# Altium schematic sheet uController.SchDoc
size A4
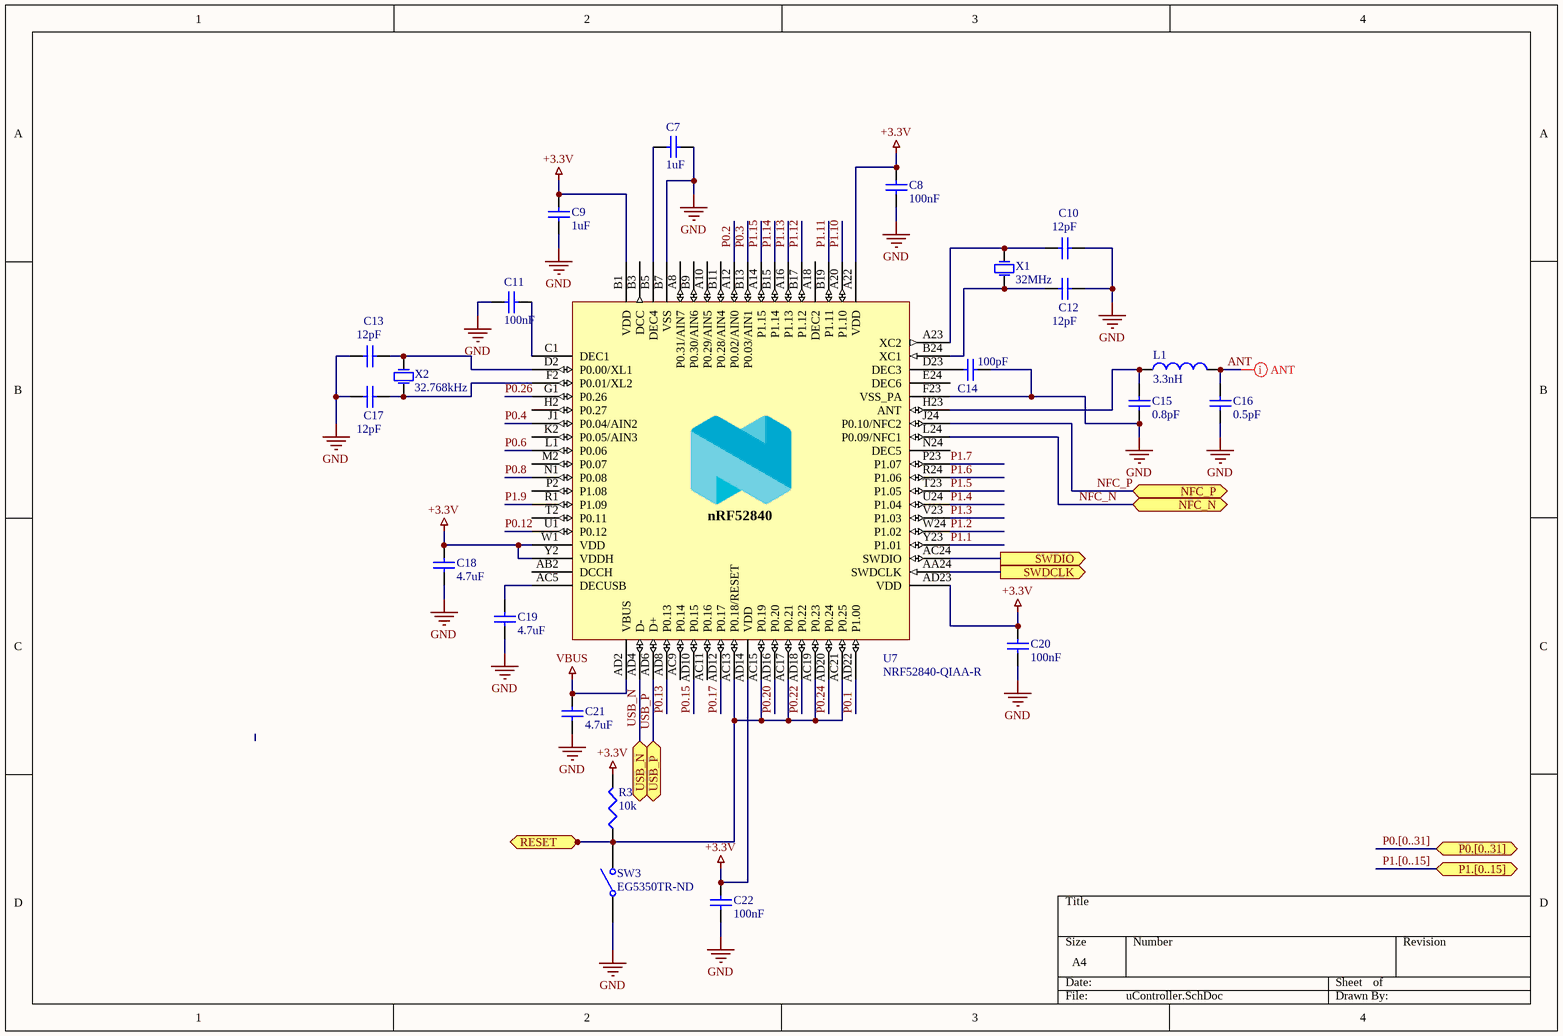
[diagram p0: uController.SchDoc]

## Parts
C7  value 1uF  (hidden comment: CL10A105KA8NNNC)
C8  value 100nF  (hidden comment: CL05A104KA5NNNC)
C9  value 1uF  (hidden comment: CL10A105KA8NNNC)
C10  value 12pF  (hidden comment: CL10C120JB8NNNC)
C11  value 100nF  (hidden comment: CL05A104KA5NNNC)
C12  value 12pF  (hidden comment: CL10C120JB8NNNC)
C13  value 12pF  (hidden comment: CL10C120JB8NNNC)
C14  value 100pF  (hidden comment: 885012206028)
C15  value 0.8pF  (hidden comment: CL10C0R8BB8NNNC)
C16  value 0.5pF  (hidden comment: CL10C0R5BB8NNNC)
C17  value 12pF  (hidden comment: CL10C120JB8NNNC)
C18  value 4.7uF  (hidden comment: CL21A475KAQNNNE)
C19  value 4.7uF  (hidden comment: CL21A475KAQNNNE)
C20  value 100nF  (hidden comment: CL05A104KA5NNNC)
C21  value 4.7uF  (hidden comment: CL21A475KAQNNNE)
C22  value 100nF  (hidden comment: CL05A104KA5NNNC)
L1  value 3.3nH  (hidden comment: CIH05T3N3SNC)
R3  value 10k  (hidden comment: RR0816P-103-D)
SW3  EG5350TR-ND  [SW1]
U7  NRF52840-QIAA-R
X1  value 32MHz  (hidden comment: NX2016SA-32MHZ-EXS00A-CS11336)
X2  value 32.768kHz  (hidden comment: Q0,032768-JTX210-9-20-T1-80K-LF)

## Ports
NFC_N, NFC_P, P0.[0..31] (bidir), P1.[0..15] (bidir), RESET (out), SWDCLK (out), SWDIO (out), USB_N, USB_P

## Nets
+3.3V: C8.1 C9.2 C18.2 C20.1 C22.1 R3.2 U7.A22(VDD) U7.AD14(VDD) U7.AD23(VDD) U7.B1(VDD) U7.W1(VDD) U7.Y2(VDDH)
GND: C7.1 C8.2 C9.1 C10.2 C11.2 C12.2 C13.1 C14.2 C15.1 C16.2 C17.1 C18.1 C19.1 C20.2 C21.1 C22.2 SW3.1 U7.B7(VSS) U7.F23(VSS_PA) X1.1(GND) X1.3(GND)
VBUS: C21.2 U7.AD2(VBUS)
ANT: C16.1 L1.2
NFC_N: U7.L24(P0.09/NFC1) ; port NFC_N
NFC_P: U7.J24(P0.10/NFC2) ; port NFC_P
P0.1: U7.AD22(P1.00)
P0.2: U7.A12(P0.02/AIN0)
P0.3: U7.B13(P0.03/AIN1)
P0.4: U7.J1(P0.04/AIN2)
P0.6: U7.L1(P0.06)
P0.8: U7.N1(P0.08)
P0.12: U7.U1(P0.12)
P0.13: U7.AD8(P0.13)
P0.15: U7.AD10(P0.15)
P0.17: U7.AD12(P0.17)
P0.20: U7.AD16(P0.20)
P0.22: U7.AD18(P0.22)
P0.24: U7.AD20(P0.24)
P0.26: U7.G1(P0.26)
P1.1: U7.Y23(P1.01)
P1.2: U7.W24(P1.02)
P1.3: U7.V23(P1.03)
P1.4: U7.U24(P1.04)
P1.5: U7.T23(P1.05)
P1.6: U7.R24(P1.06)
P1.7: U7.P23(P1.07)
P1.9: U7.R1(P1.09)
P1.10: U7.A20(P1.10)
P1.11: U7.B19(P1.11)
P1.12: U7.B17(P1.12)
P1.13: U7.A16(P1.13)
P1.14: U7.B15(P1.14)
P1.15: U7.A14(P1.15)
RESET: R3.1 SW3.3 U7.AC13(P0.18/RESET) U7.AC15(P0.19) U7.AC17(P0.21) U7.AC19(P0.23) U7.AC21(P0.25) ; port RESET
SWDCLK: U7.AA24(SWDCLK) ; port SWDCLK
SWDIO: U7.AC24(SWDIO) ; port SWDIO
USB_N: U7.AD4(D-) ; port USB_N
USB_P: U7.AD6(D+) ; port USB_P
NetC7_2: C7.2 U7.B5(DEC4)
NetC10_1: C10.1 U7.A23(XC2) X1.4(OSC2)
NetC11_1: C11.1 U7.C1(DEC1)
NetC12_1: C12.1 U7.B24(XC1) X1.2(OSC1)
NetC13_2: C13.2 U7.D2(P0.00/XL1) X2.2(OSC2)
NetC14_1: C14.1 U7.D23(DEC3)
NetC15_2: C15.2 L1.1 U7.H23(ANT)
NetC17_2: C17.2 U7.F2(P0.01/XL2) X2.1(OSC1)
NetC19_2: C19.2 U7.AC5(DECUSB)

Not connected (* = marked no-connect by the designer): SW3 2 4; U7 A8(P0.31/AIN7) A10(P0.29/AIN5) A18(DEC2) AB2(DCCH) AC9(P0.14) AC11(P0.16) B3(DCC) B9(P0.30/AIN6) B11(P0.28/AIN4) E24(DEC6) H2(P0.27) K2(P0.05/AIN3) M2(P0.07) N24(DEC5) P2(P1.08) T2(P0.11)

## Buses and harness runs
bus P0.[0..31] = port P0.[0..31]
bus P1.[0..15] = port P1.[0..15]

## Layout directives
net class ANT: ANT

## Notes on the sheet
- (in symbol NRF52840-QIAA-R) nRF52840

## Library data of the parts
C7 C9 = CL10A105KA8NNNC: Cap Ceramic 1uF 25V X5R 10% SMD 0603 85C Paper T/R; Manufacturer: Samsung; Supplier 1: Digi-Key; Manufacturer Part Number: CL10A105KA8NNNC; Stock 1: 40000; Pricing 1: 1=0.1, 10=0.052, 100=0.0231, 500=0.0165, 1000=0.013 (USD); Mount: Surface Mount; Case/Package: 0603; Case Code (Metric): 1608; Case Code (Imperial): 0603; Material: Ceramic; Contact Plating: Tin; Min Operating Temperature: -55°C; Max Operating Temperature: 85°C; Capacitance: 1uF; Tolerance: 10%; Dielectric: X5R; Voltage: 25V; Voltage Rating (DC): 25V; Packaging: Tape and Reel; Package Quantity: 1; Voltage Rating: 25V; Length: 1.6mm; Height: 0.8mm; Depth: 0.8mm; Width: 0.031inch; Thickness: 0.035inch; Radiation Hardening: No; Lead Free: Lead Free; Supplier Part Number 1: 1276-1102-1-ND
C8 C11 C20 C22 = CL05A104KA5NNNC: Cap Ceramic 0.1uF 25V X5R 10% SMD 0402 85C Paper T/R; Manufacturer: Samsung; Supplier 1: Digi-Key; Manufacturer Part Number: CL05A104KA5NNNC; Stock 1: 100000; Pricing 1: 1=0.1, 10=0.04, 100=0.0176, 500=0.0126, 1000=0.0099, 2500=0.009, 5000=0.0083 (USD); Mount: Surface Mount; Case/Package: 0402; Case Code (Metric): 1005; Case Code (Imperial): 0402; Min Operating Temperature: -55°C; Max Operating Temperature: 85°C; Capacitance: 100nF; Packaging: Tape and Reel; Tolerance: 10%; Package Quantity: 1; Voltage Rating: 25V; Dielectric: X5R; Voltage: 25V; Voltage Rating (DC): 25V; Length: 1mm; Height: 0.5mm; Width: 0.02inch; Thickness: 0.022inch; Depth: 0.5mm; Radiation Hardening: No; Lead Free: Lead Free; Supplier Part Number 1: 1276-1043-1-ND
C10 C12 C13 C17 = CL10C120JB8NNNC: Cap Ceramic 12pF 50V C0G 5% SMD 0603 125C Paper T/R; Manufacturer: Samsung; Temperature Coefficient: 300ppm/°C; Supplier 1: Digi-Key; Manufacturer Part Number: CL10C120JB8NNNC; Stock 1: 40000; Pricing 1: 1=0.1, 10=0.07, 100=0.0314, 500=0.0224, 1000=0.0176 (USD); Mount: Surface Mount; Case/Package: 0603; Case Code (Metric): 1608; Case Code (Imperial): 0603; Material: Ceramic; Contact Plating: Tin; Min Operating Temperature: -55°C; Max Operating Temperature: 125°C; Tolerance: 5%; Capacitance: 12pF; Dielectric: C0G; Voltage: 50V; Voltage Rating (DC): 50V; Voltage Rating: 50V; Package Quantity: 1; Packaging: Tape and Reel; Length: 1.6mm; Height: 0.8mm; Depth: 0.8mm; Width: 0.031inch; Thickness: 0.035inch; Radiation Hardening: No; Lead Free: Lead Free; Supplier Part Number 1: 1276-1254-1-ND
C14 = 885012206028: Wurth Elektronik 0603 WCAP-CSGP 100pF Ceramic Multilayer Capacitor, 16 V dc, +125°C, X7R Dielectric, ±10%; Manufacturer: Wurth Electronics; Voltage Rating: 16V; Supplier 1: Digi-Key; Manufacturer Part Number: 885012206028; Stock 1: 4208; Pricing 1: 1=0.1, 10=0.021, 100=0.0192, 500=0.017 (USD); Mount: Surface Mount; Case/Package: 0603; Case Code (Metric): 1608; Case Code (Imperial): 0603; Min Operating Temperature: -55°C; Max Operating Temperature: 125°C; Packaging: Tape and Reel; Capacitance: 100pF; Tolerance: 10%; Length: 0.063inch; Width: 0.031inch; Thickness: 0.034inch; Supplier Part Number 1: 732-7947-1-ND
C15 = CL10C0R8BB8NNNC: Cap Ceramic 0.8pF 50V C0G 0.1pF SMD 0603 125C Paper T/R; Manufacturer: Samsung; Supplier 1: Digi-Key; Manufacturer Part Number: CL10C0R8BB8NNNC; Stock 1: 40000; Pricing 1: 1=0.1, 10=0.059, 100=0.0264, 500=0.0189, 1000=0.0148 (USD); Mount: Surface Mount; Case/Package: 0603; Case Code (Metric): 1608; Case Code (Imperial): 0603; Min Operating Temperature: -55°C; Max Operating Temperature: 125°C; Capacitance: 0.8pF; Packaging: Tape and Reel; Package Quantity: 1; Voltage Rating: 50V; Dielectric: C0G; Voltage Rating (DC): 50V; Length: 1.6mm; Height: 0.8mm; Width: 0.031inch; Thickness: 0.035inch; Depth: 0.8mm; Radiation Hardening: No; Supplier Part Number 1: 1276-2148-1-ND
C16 = CL10C0R5BB8NNNC: Cap Ceramic 0.5pF 50V C0G 0.1pF SMD 0603 125C Paper T/R; Manufacturer: Samsung; Dielectric: NP0; Temperature Coefficient: 300ppm/°C; Supplier 1: Digi-Key; Manufacturer Part Number: CL10C0R5BB8NNNC; Stock 1: 28897; Pricing 1: 1=0.1, 10=0.049, 100=0.0217, 500=0.0155, 1000=0.0122 (USD); Mount: Surface Mount; Case/Package: 0603; Case Code (Metric): 1608; Case Code (Imperial): 0603; Material: Ceramic; Contact Plating: Matte,Tin; Min Operating Temperature: -55°C; Max Operating Temperature: 125°C; Voltage Rating: 50V; Package Quantity: 1; Packaging: Tape and Reel; Capacitance: 0.5pF; Voltage: 50V; Length: 1.6mm; Height: 0.8mm; Width: 0.031inch; Thickness: 0.035inch; Depth: 0.8mm; Radiation Hardening: No; Supplier Part Number 1: 1276-1818-1-ND
C18 C19 C21 = CL21A475KAQNNNE: Cap Ceramic 4.7uF 25V X5R 10% SMD 0805 85C Embossed T/R; Manufacturer: Samsung; Supplier 1: Digi-Key; Manufacturer Part Number: CL21A475KAQNNNE; Stock 1: 20000; Pricing 1: 1=0.23, 10=0.158, 100=0.0802, 500=0.0549, 1000=0.0485 (USD); Mount: Surface Mount; Case/Package: 0805; Case Code (Metric): 2012; Case Code (Imperial): 0805; Min Operating Temperature: -55°C; Max Operating Temperature: 85°C; Package Quantity: 1; Packaging: Tape and Reel; Capacitance: 4.7uF; Tolerance: 10%; Voltage Rating: 25V; Dielectric: X5R; Voltage Rating (DC): 25V; Length: 2mm; Height: 1.25mm; Width: 0.049inch; Thickness: 0.055inch; Depth: 1.25mm; Radiation Hardening: No; Lead Free: Lead Free; Supplier Part Number 1: 1276-1244-1-ND
L1 = CIH05T3N3SNC: Inductor High Frequency Chip Multi-Layer 3.3nH 0.3nH 100MHz 8Q-Factor Ceramic 300mA 190mOhm DCR 0402 T/R; Manufacturer: Samsung; Shielding: Unshielded; DC Resistance (DCR): 190mR; Self Resonant Frequency: 6GHz; Supplier 1: Digi-Key; Manufacturer Part Number: CIH05T3N3SNC; Stock 1: 68140; Pricing 1: 1=0.1, 10=0.015, 100=0.0102, 500=0.0082, 1000=0.007, 2500=0.0063 (USD); Mount: Surface Mount; Case/Package: 0402; Case Code (Metric): 1005; Case Code (Imperial): 0402; Core Material: Ceramic; Min Operating Temperature: -55°C; Max Operating Temperature: 125°C; Packaging: Cut Tape; Current Rating: 300mA; Inductance: 3.3nh; Test Frequency: 100MHz; Max DC Current: 300mA; DC Current: 300mA; Military Standard: Not; Length: 0.039inch; Height: 0.55mm; Width: 0.02inch; Depth: 0.55mm; Radiation Hardening: No; Lead Free: Lead Free; Supplier Part Number 1: 1276-6294-1-ND
R3 = RR0816P-103-D: RES SMD 10K OHM 0.5% 1/16W 0603; Manufacturer: Susumu; Power (Watts): 0.063W, 1/16W; Temperature Coefficient: ±25ppm/°C; Supplier 1: Digi-Key; Manufacturer Part Number: RR0816P-103-D; RoHS: RoHS Compliant; Category: Resistors; Stock 1: 362461; Pricing 1: 1=0.09, 10=0.084, 100=0.0321, 1000=0.01412, 2500=0.01219 (EUR); Packaging: Cut Tape (CT); Part Status: Active; Tolerance: ±0.5%; Composition: Thin Film; Features: -; Operating Temperature: -55°C ~ 125°C; Package / Case: 0603 (1608 Metric); Supplier Device Package: -; Size / Dimension: 0.063" L x 0.032" W (1.60mm x 0.80mm); Height - Seated (Max): 0.020" (0.50mm); Failure Rate: -; ComponentLink1URL: http://www.susumu.co.jp/common/pdf/n_catalog_partition05_en.pdf; ComponentLink1Description: http://www.susumu.co.jp/common/pdf/n_catalog_partition05_en.pdf; Supplier Part Number 1: RR08P10.0KDCT-ND
SW3 = TL3305AF160QG: SWITCH TACTILE SPST-NO 50MA 12V; Manufacturer: E-Switch; Switch Function: Off-Mom; Contact Rating @ Voltage: 0.05A @ 12VDC; Actuator Type: Standard; Actuator Height off PCB, Vertical: 3.80mm; Actuator Orientation: Top Actuated; Outline: 4.50mm x 4.50mm; Illumination: Non-Illuminated; Operating Force: 160gf; Switch Travel: 0.20mm; Mechanical Life: 500,000 Cycles; Checked: 0; Supplier 1: Digi-Key; Manufacturer Part Number: TL3305AF160QG; RoHS: RoHS Compliant; Category: Switches; Stock 1: 50000; Pricing 1: 2000=0.08803, 6000=0.07294 (EUR); Packaging: Tape & Reel (TR); Part Status: Active; Circuit: SPST-NO; Mounting Type: Surface Mount; Actuator Length, Right Angle: -; Termination Style: Gull Wing; Illumination Type, Color: -; Illumination Voltage (Nominal): -; Ingress Protection: -; Features: -; Operating Temperature: -20°C ~ 70°C; Actuator Material: -; ComponentLink1URL: http://spec_sheets.e-switch.com/specs/P010468.pdf; ComponentLink1Description: http://spec_sheets.e-switch.com/specs/P010468.pdf; Supplier Part Number 1: EG5350TR-ND
U7 = NRF52840-QIAA-R: Manufacturer: Nordic Semiconductor; Supplier 1: Digi-Key; Manufacturer Part Number: NRF52840-QIAA-R; Stock 1: 13083; Pricing 1: 1=7.43, 10=6.815, 25=6.1952, 100=5.5755, 250=5.1109, 500=4.6463, 1000=4.1816 (USD); Supplier Part Number 1: 1490-1071-1-ND
X1 = NX2016SA-32MHZ-EXS00A-CS11336: Manufacturer: NDK; Supplier 1: Digi-Key; Manufacturer Part Number: NX2016SA-32MHZ-EXS00A-CS11336; Stock 1: 2762; Pricing 1: 1=0.64, 10=0.531, 50=0.4776, 100=0.4246, 500=0.4034, 1000=0.3397 (USD); Supplier Part Number 1: 644-1324-1-ND
X2 = Q0,032768-JTX210-9-20-T1-80K-LF: Manufacturer: Jauch; Supplier 1: Digi-Key; Manufacturer Part Number: Q0,032768-JTX210-9-20-T1-80K-LF; Stock 1: 0; Supplier Part Number 1: 1908-1304-2-ND